# Altium schematic sheet H_bridge.SchDoc: H_bridge
size OrCAD A; ApprovedBy: Abbsa Mahmoud; CheckedBy: Abbas mahmoud; Author: Abbas Mahmoud; CompanyName: lsa 4wya :); DrawnBy: Abbas Mahmoud; Engineer: Abbas Mahmoud; DocumentNumber: 2; SheetNumber: 2; SheetTotal: 8
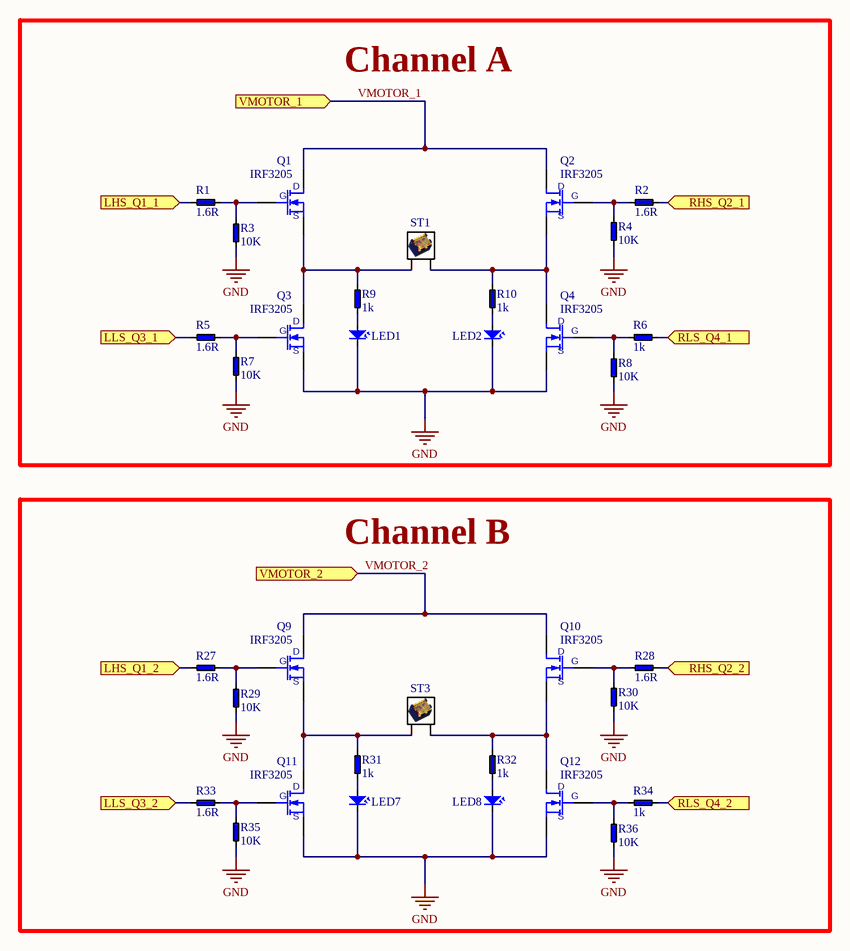
[diagram p0: H_bridge.SchDoc]

## Parts
LED1  LED  [LED 3MM BLUE]  (value not drawn)
LED2  LED  [LED 3MM BLUE]  (value not drawn)
LED7  LED  [LED 3MM BLUE]  (value not drawn)
LED8  LED  [LED 3MM BLUE]  (value not drawn)
Q1  IRF3205  [Transistor - duplicate2]
Q2  IRF3205  [Transistor - duplicate2]
Q3  IRF3205  [Transistor - duplicate2]
Q4  IRF3205  [Transistor - duplicate2]
Q9  IRF3205  [Transistor - duplicate2]
Q10  IRF3205  [Transistor - duplicate2]
Q11  IRF3205  [Transistor - duplicate2]
Q12  IRF3205  [Transistor - duplicate2]
R1  1.6R  [RESISTOR _9]
R2  1.6R  [RESISTOR _9]
R3  10K  [RESISTOR _9]
R4  10K  [RESISTOR _9]
R5  1.6R  [RESISTOR _9]
R6  1k  [RESISTOR _9]
R7  10K  [RESISTOR _9]
R8  10K  [RESISTOR _9]
R9  1k  [RESISTOR _9]
R10  1k  [RESISTOR _9]
R27  1.6R  [RESISTOR _9]
R28  1.6R  [RESISTOR _9]
R29  10K  [RESISTOR _9]
R30  10K  [RESISTOR _9]
R31  1k  [RESISTOR _9]
R32  1k  [RESISTOR _9]
R33  1.6R  [RESISTOR _9]
R34  1k  [RESISTOR _9]
R35  10K  [RESISTOR _9]
R36  10K  [RESISTOR _9]
ST1  SCREW TERMINAL  [SCREW TERMINAL]  (value not drawn)
ST3  SCREW TERMINAL  [SCREW TERMINAL]  (value not drawn)

## Blocks framed on the sheet
Channel A: LED1 LED2 Q1-Q4 R1-R10 ST1
Channel B: LED7 LED8 Q9-Q12 R27-R36 ST3

## Ports
LHS_Q1_1 (in), LHS_Q1_2 (in), LLS_Q3_1 (in), LLS_Q3_2 (in), RHS_Q2_1 (in), RHS_Q2_2 (in), RLS_Q4_1 (in), RLS_Q4_2 (in), VMOTOR_1 (in), VMOTOR_2 (in)

## Nets
GND: LED1.K LED2.K LED7.K LED8.K Q3.3(S) Q4.3(S) Q11.3(S) Q12.3(S) R3.1 R4.1 R7.1 R8.1 R29.1 R30.1 R35.1 R36.1
LHS_Q1_1: R1.1 ; port LHS_Q1_1
LHS_Q1_2: R27.1 ; port LHS_Q1_2
LLS_Q3_1: R5.1 ; port LLS_Q3_1
LLS_Q3_2: R33.1 ; port LLS_Q3_2
RHS_Q2_1: R2.2 ; port RHS_Q2_1
RHS_Q2_2: R28.2 ; port RHS_Q2_2
RLS_Q4_1: R6.2 ; port RLS_Q4_1
RLS_Q4_2: R34.2 ; port RLS_Q4_2
VMOTOR_1: Q1.2(D) Q2.2(D) ; port VMOTOR_1
VMOTOR_2: Q9.2(D) Q10.2(D) ; port VMOTOR_2
NetLED1_A: LED1.A R9.1
NetLED2_A: LED2.A R10.1
NetLED7_A: LED7.A R31.1
NetLED8_A: LED8.A R32.1
NetQ1_1: Q1.1(G) R1.2 R3.2
NetQ1_3: Q1.3(S) Q3.2(D) R9.2 ST1.1(AC)
NetQ2_1: Q2.1(G) R2.1 R4.2
NetQ2_3: Q2.3(S) Q4.2(D) R10.2 ST1.2(AC)
NetQ3_1: Q3.1(G) R5.2 R7.2
NetQ4_1: Q4.1(G) R6.1 R8.2
NetQ9_1: Q9.1(G) R27.2 R29.2
NetQ9_3: Q9.3(S) Q11.2(D) R31.2 ST3.1(AC)
NetQ10_1: Q10.1(G) R28.1 R30.2
NetQ10_3: Q10.3(S) Q12.2(D) R32.2 ST3.2(AC)
NetQ11_1: Q11.1(G) R33.2 R35.2
NetQ12_1: Q12.1(G) R34.1 R36.2

## Notes on the sheet
- Title
- Size:
- Date:
- Orcad A
- Number:
- Time:
- Revision:
- Sheet
- of
- File:

## Library data of the parts
Q1-Q4 Q9-Q12 = MOSFET-N: N CHANNEL MOSFET
R1-R10 R27-R36 = RESISTOR
ST1 ST3 = SCREW TERMINAL: Barrier Terminal Block 2 Pin with cover 300V/25A